# EAGLE design Environment-ArduinoNano33-V10-StencilHolder (EAGLE 7.4.0)
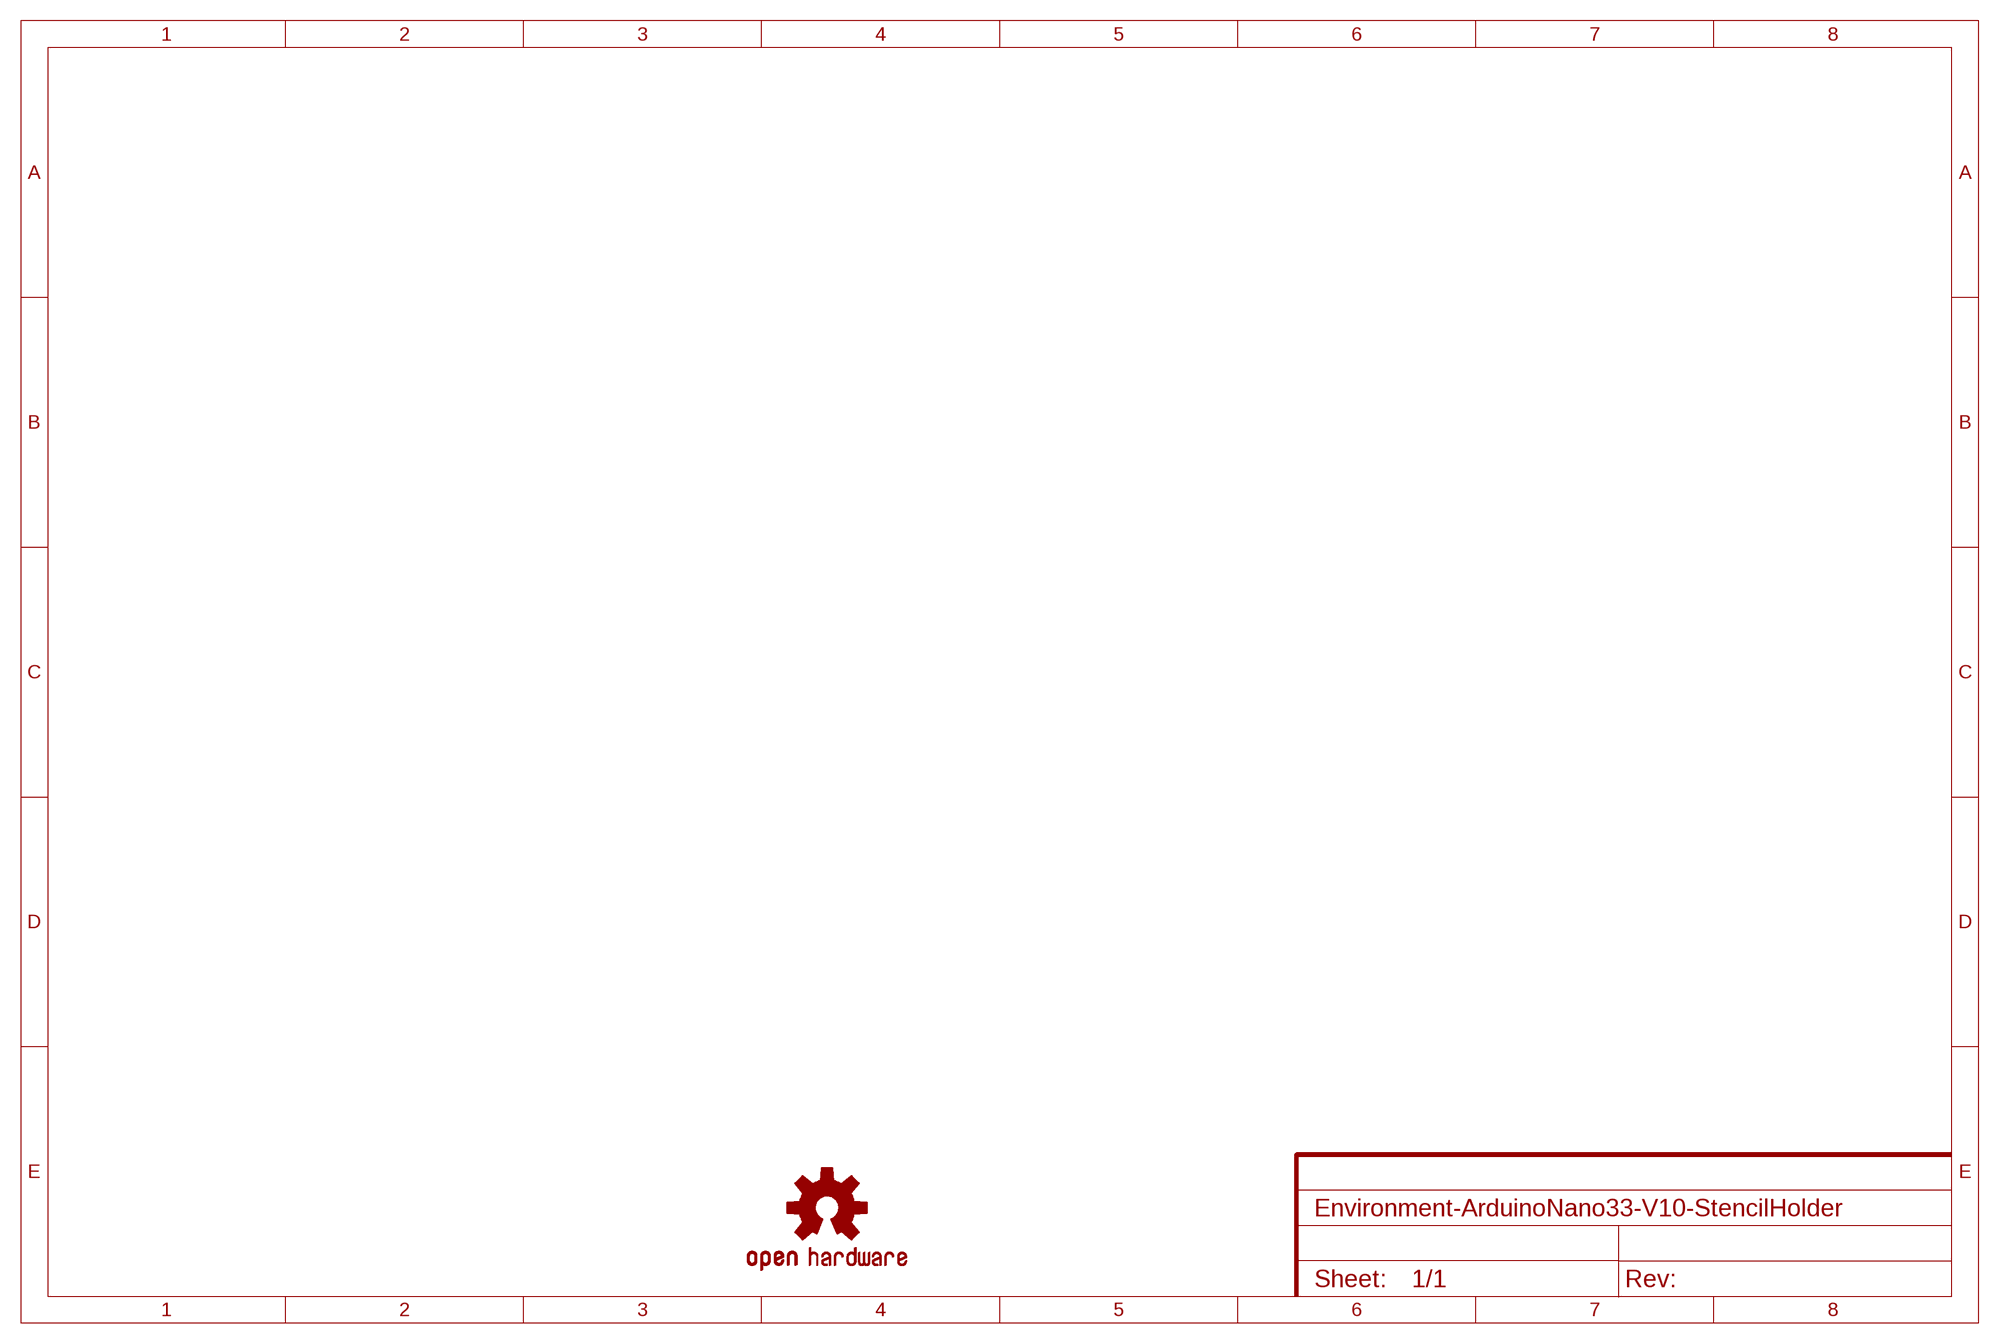
[diagram p0: schematic, sheet 1]

## Parts
LOGO3  OSHW-LOGOL  [OSHW-LOGO-L]

## Library data of the parts
LOGO3 = SparkFun-Aesthetics:OSHW-LOGO: Open-Source Hardware (OSHW) Logo This logo indicates the piece of hardware it is found on incorporates a OSHW license and/or adheres to the definition of open source hardware found here: http://freedomdefined.org/OSHW

## Board
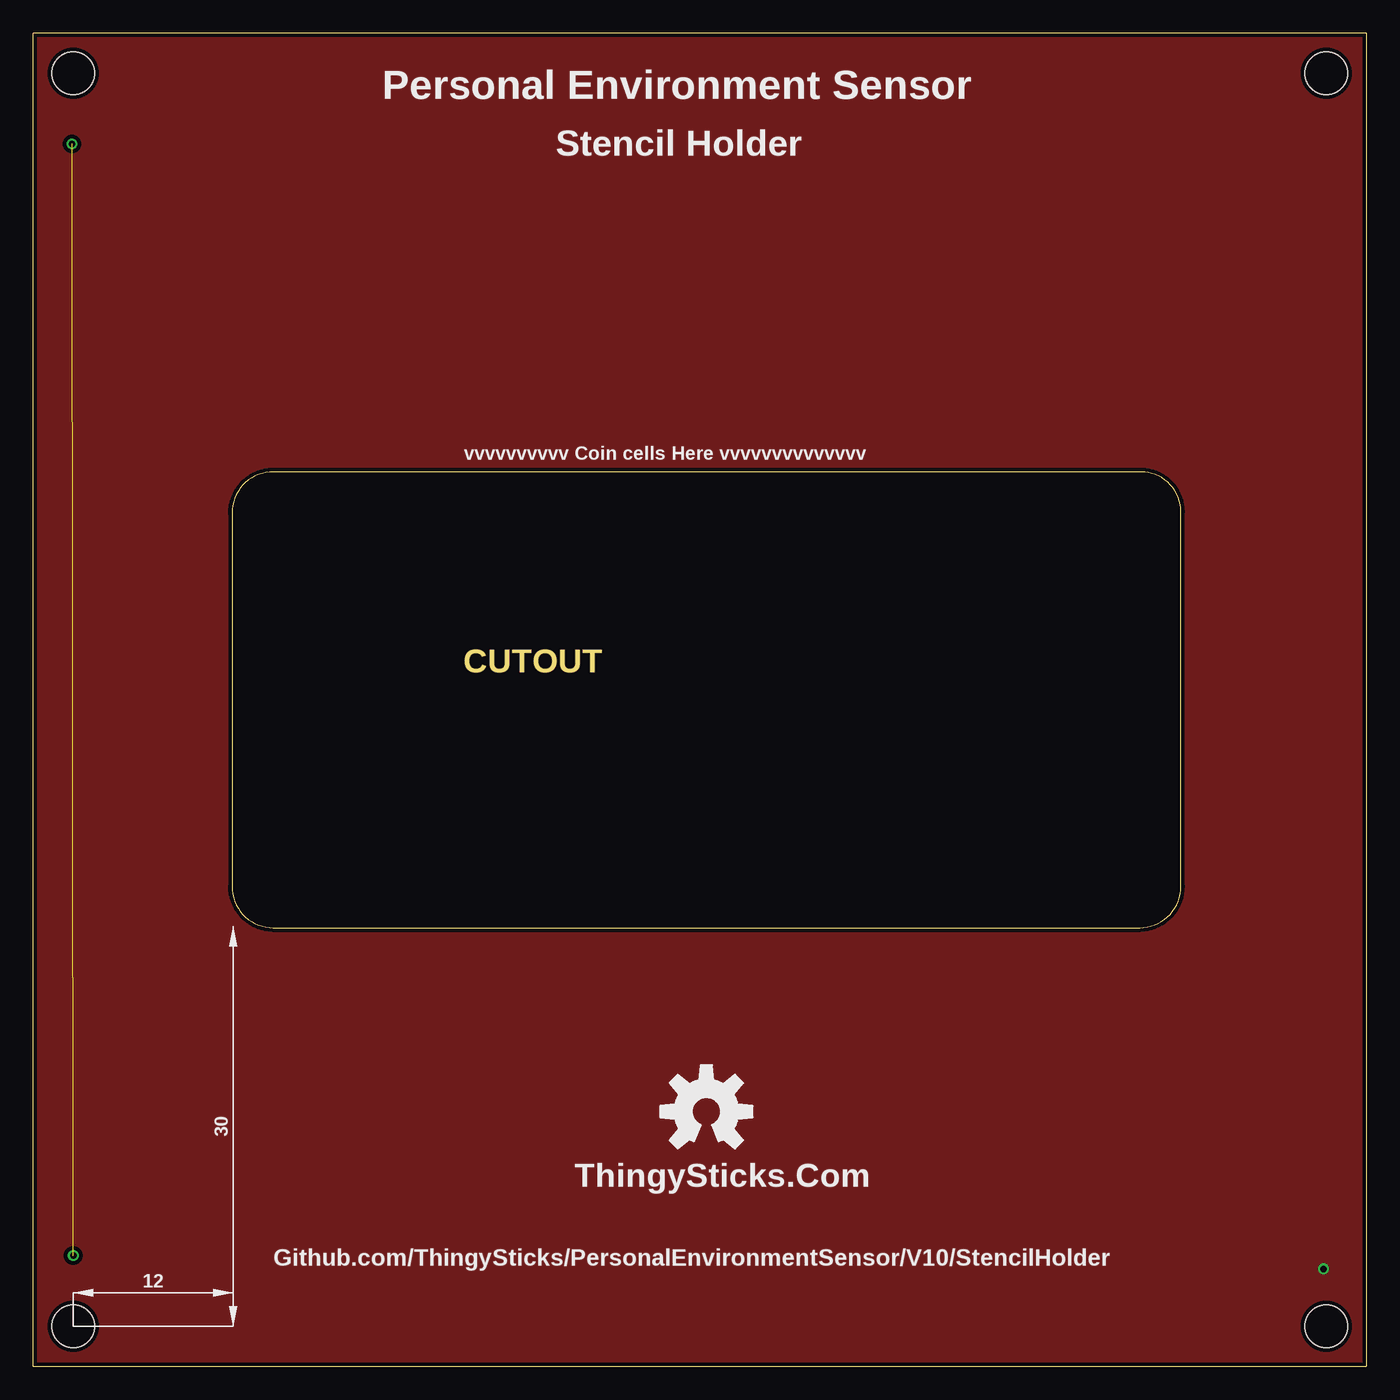
[diagram p1: board, top side]
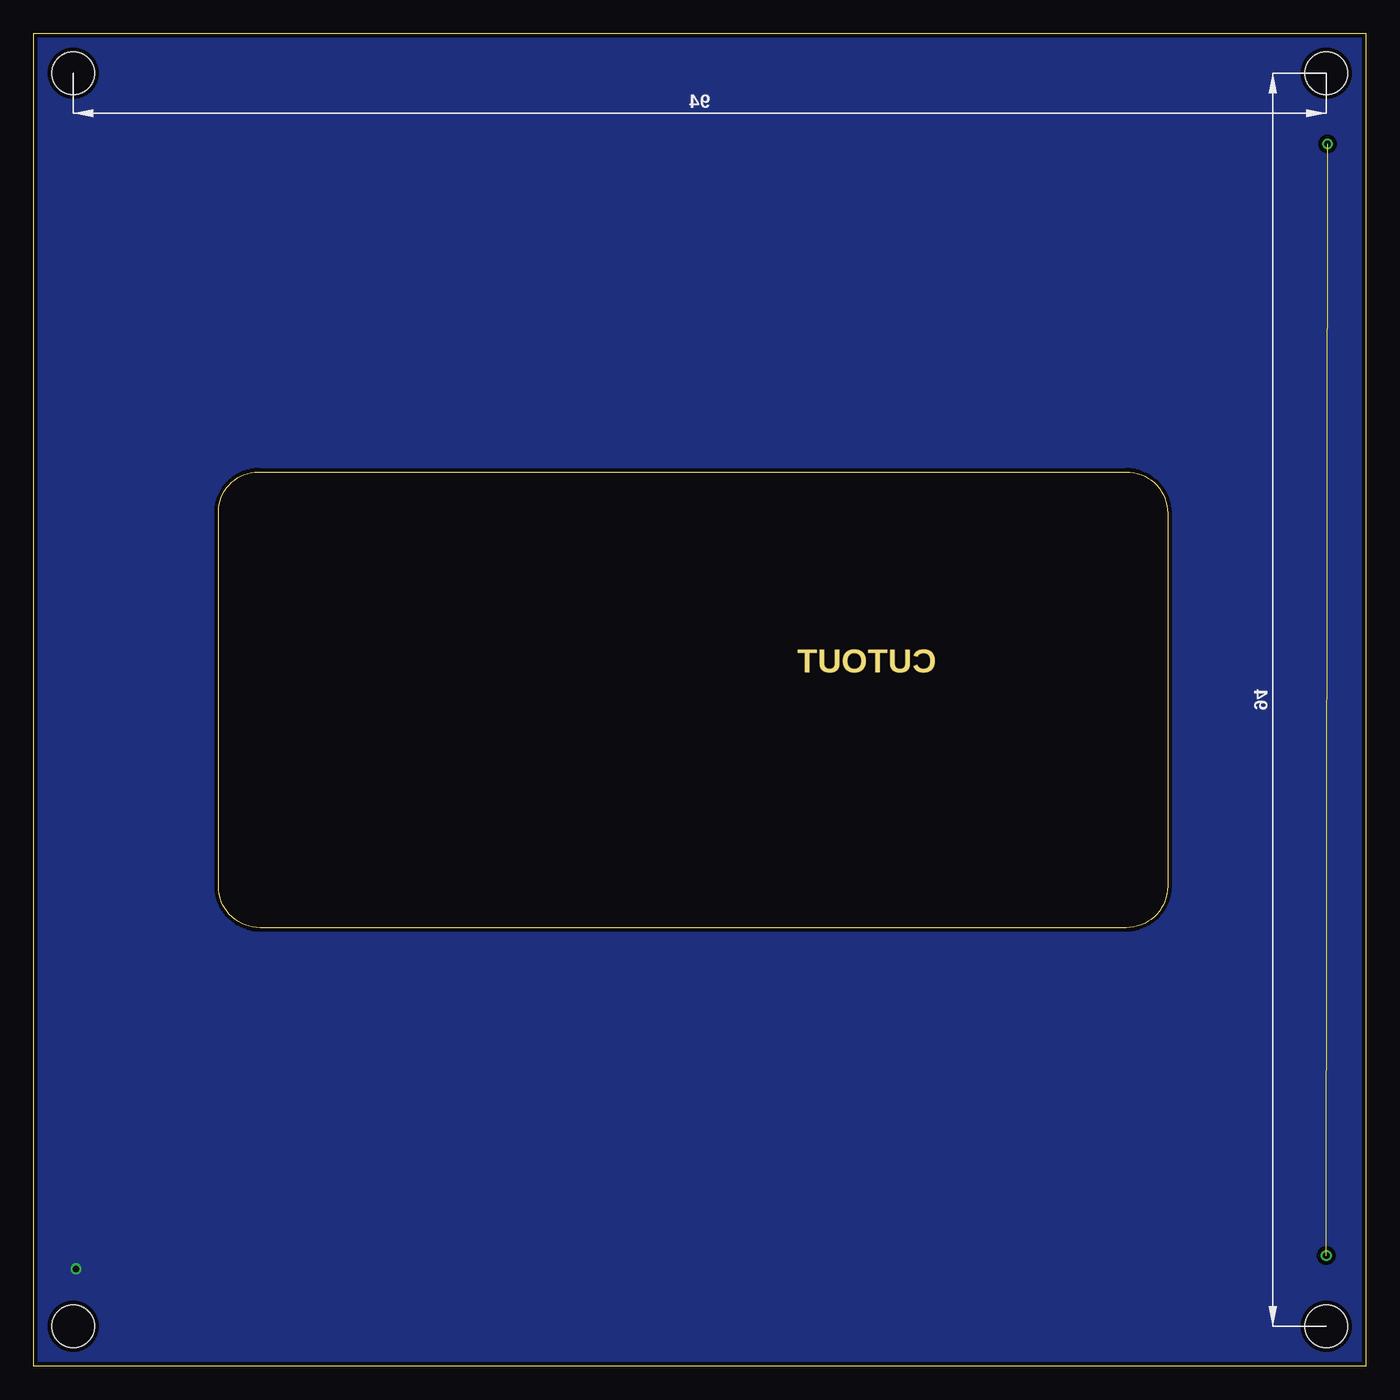
[diagram p2: board, bottom side, seen from below]

Size 100 x 100 mm. Coordinates in mm from the lower left corner, seen from the top.
Outline: 0,0 0,100 100,100 100,0 0,0
Outline: 18,67.1 arc90 14.9,64 14.9,36 arc90 18,32.9 83,32.9 arc90 86.1,36 86.1,64.1 arc90 83.1,67.1 18,67.1
Copper layers (1*16): Top 0.035mm / dielectric 1.5mm / Bottom 0.035mm
Design rules "dirt_cheap_dirty_boards.v1.1": minimum track width 6mil, minimum drill 12mil, track to track 6mil, track to pad 6mil, pad to pad 6mil, via to via 6mil, smd to smd 0mil, copper to edge 10mil, drill to drill 10mil, minimum pad ring 10mil, minimum via ring 6mil, stop-mask expansion 2mil, vias tented up to drill 25mil, thermal gap 10mil
Holes 3.2 mm at 3,3 97,3 97,97 3,97

### Placement (x,y rotation side)
LOGO3  50.5,19.1 0 top

### Tracks (layer width: path | path; a pad name or v marks a point on that pad's centre or on a via)
GND  (via drill 0.5)
  other vias: 96.8,7.3
  pour Bottom (isolate 0.305, rank 4): 0,100 100,100 100,0 0,-0.5
  pour Top (isolate 0.305, rank 4): 0,100 100,100 100,0 0,-0.5
N$1  (via drill 0.5)  (1 unrouted)
  other vias: 3,8.3 2.9,91.7

### Text on the board
Dimension: CUTOUT
tNames: Personal Environment Sensor | Stencil Holder | vvvvvvvvvv Coin cells Here vvvvvvvvvvvvvv | ThingySticks.Com | Github.com/ThingySticks/PersonalEnvironmentSensor/V10/StencilHolder